# Altium project ir_probe.PrjPcb
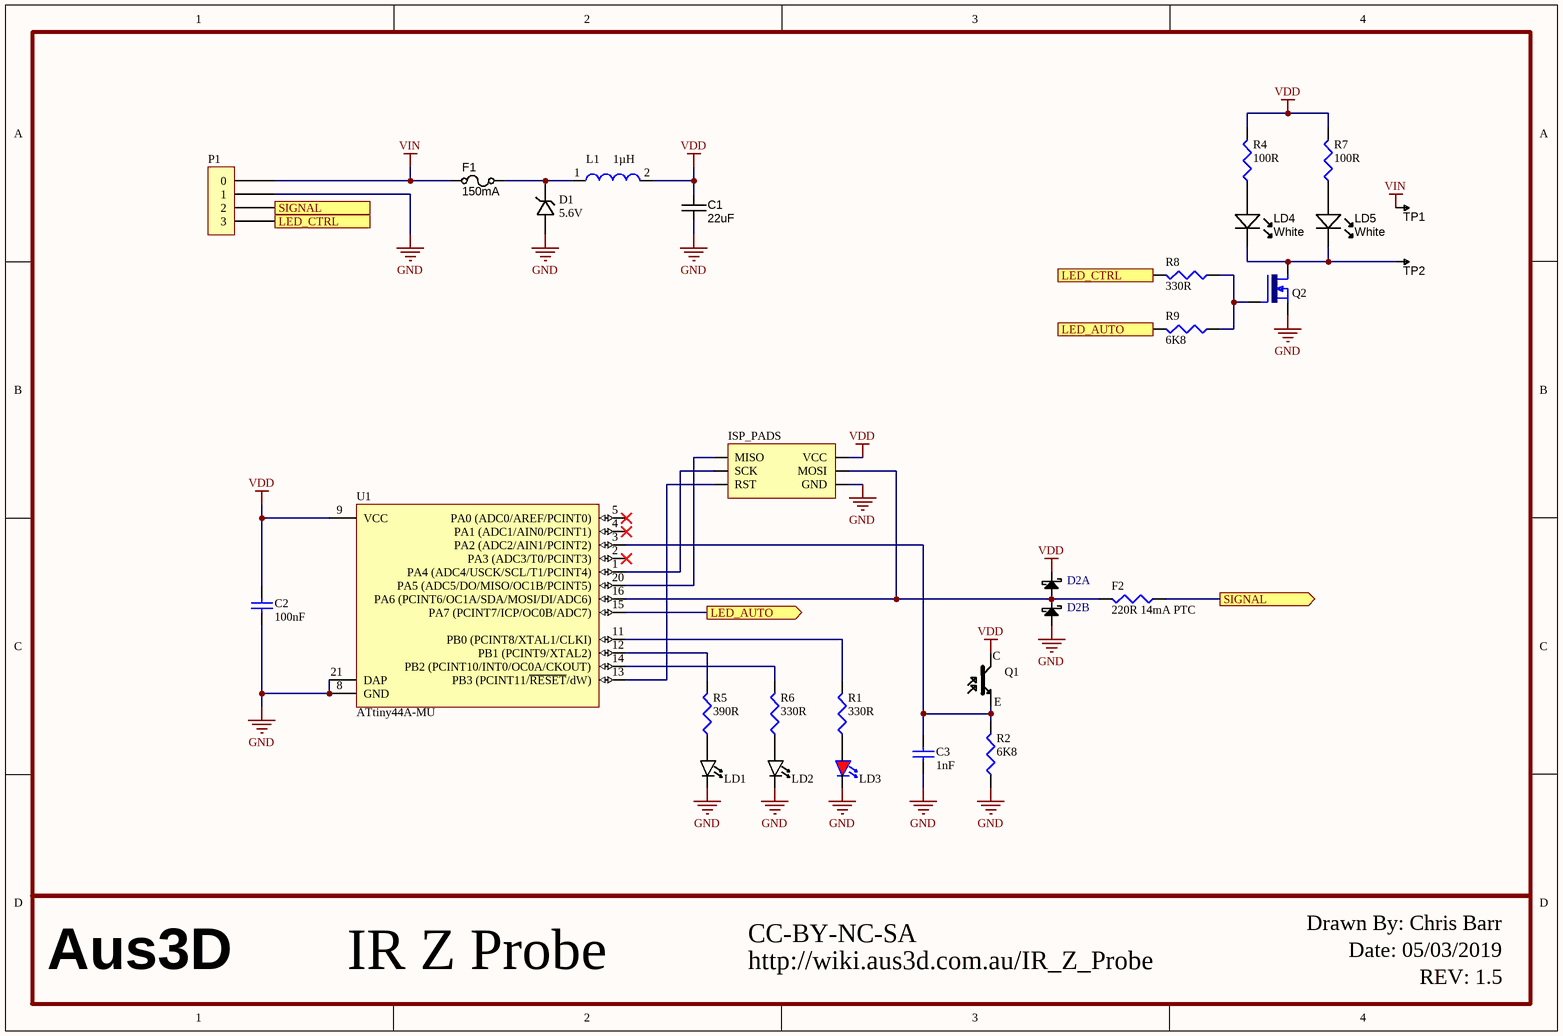
[diagram p0: ir_probe.SchDoc]
1 sheet, 28 parts. Net scope: flat (ports and power ports of the same name join across sheets).
Board file: ir_probe.PcbDoc

## Sheet ir_probe.SchDoc
size A4

### Parts
C1  value 22uF  [CAPC3216X180N]  (hidden comment: 22uF 20% 16V X7R 1206)
C2  value 100nF  [CAPC1608X90N]  (hidden comment: 100nF 10% 50V X7R 0603)
C3  value 1nF  [CAPC1608X90N]  (hidden comment: 1nF 10% 50V X7R 0603)
D1  value 5.6V  [SOD123]  (hidden comment: 5.6V 0.5W SOD-123)
D2  Dual 100mA 30V SOT23-3  [SOT23-3 New]  (value not drawn)  (parts A,B of 2)
F1  value 150mA  [RES 3216-1206]  (hidden comment: 60V 200mA Hold 400mA Trip 1206)
F2  value 220R 14mA PTC  [RESC1608X55N]  (hidden comment: 24V 14mA Hold 29mA Trip 220R 0603)
ISP_PADS  ISP  [ICSP Pads]  (value not drawn)  (no BOM)
L1  Inductance: 1µH  [SMD-0603]  (hidden comment: 1uH 20% 600mA 0603)
LD1  IR 950nm 1.6V 70mA Side-View  [SFH 4045N IR LED]  (value not drawn)
LD2  IR 950nm 1.6V 70mA Side-View  [SFH 4045N IR LED]  (value not drawn)
LD3  Red 0603  [LED 1608-0603]  (value not drawn)
LD4  Color: White  [LED-0602-SideView]  (hidden comment: White Side-View 0602)
LD5  Color: White  [LED-0602-SideView]  (hidden comment: White Side-View 0602)
P1  JST-SH 4P Side-Entry .1"  [SM04B-SRSS-TB]  (value not drawn)
Q1  NPN 30V 15mA IR 870nm Side-View  [SFH 4045N IR LED]  (value not drawn)
Q2  N-CH MOSFET 30V 5.7A SOT23  [SOT23-3 New]  (value not drawn)
R1  value 330R  [RESC1608X55N]  (hidden comment: 330R 1% 100mW 0603)
R2  value 6K8  [RESC1608X55N]  (hidden comment: 6K8 1% 100mW 0603)
R4  value 100R  [RES 1608-0603]  (hidden comment: 100R 1% 100mW 0603)
R5  value 390R  [RESC1608X55N]  (hidden comment: 390R 1% 100mW 0603)
R6  value 330R  [RESC1608X55N]  (hidden comment: 330R 1% 100mW 0603)
R7  value 100R  [RES 1608-0603]  (hidden comment: 100R 1% 100mW 0603)
R8  value 330R  [RESC1608X55N]  (hidden comment: 330R 1% 100mW 0603)
R9  value 6K8  [RESC1608X55N]  (hidden comment: 6K8 1% 100mW 0603)
TP1  TESTPOINT  [TP-R60]  (value not drawn)  (no BOM)
TP2  TESTPOINT  [TP-R60]  (value not drawn)  (no BOM)
U1  value ATtiny44A-MU  [20M1_N]  (hidden comment: ATtiny44A-MU - 8-bit AVR Microcontroller,  20MHz, 1.8-5.5V, 4KB Flash, 256 Bytes EEPROM, 256 Bytes SRAM, 20-pin MLF, Industrial Grade (-40°C to 85°C), Pb-Free)

### Ports
LED_AUTO (in), LED_AUTO (out), LED_CTRL (in), LED_CTRL (out), SIGNAL (in), SIGNAL (out)

### Nets
GND: C1.2 C2.1 C3.1 D1.A D2.1(A) ISP_PADS.5(GND) LD1.1(K) LD2.1(K) LD3.2(K) P1.1 Q2.2(S) R2.1 U1.8(GND) U1.21(DAP)
VDD: C1.1 C2.2 D2.2(K) ISP_PADS.1(VCC) L1.2 Q1.2 R4.2 R7.2 U1.9(VCC)
VIN: F1.1 P1.0 TP1.1
NetC3_2: C3.2 Q1.1 R2.2 U1.3(PA2_(ADC2/AIN1/PCINT2))
NetD1_K: D1.K F1.2 L1.1
NetD2_3: D2.3(A) F2.2 ISP_PADS.3(MOSI) U1.16(PA6_(PCINT6/OC1A/SDA/MOSI/DI/ADC6))
NetF2_1: F2.1 P1.2 ; port SIGNAL
NetISP_PADS_0: ISP_PADS.0(MISO) U1.20(PA5_(ADC5/DO/MISO/OC1B/PCINT5))
NetISP_PADS_2: ISP_PADS.2(SCK) U1.1(PA4_(ADC4/USCK/SCL/T1/PCINT4))
NetISP_PADS_4: ISP_PADS.4(RST) U1.13(PB3_(PCINT11/~{RESET}/dW))
NetLD1_2: LD1.2(A) R5.1
NetLD2_2: LD2.2(A) R6.1
NetLD3_1: LD3.1(A) R1.1
NetLD4_A: LD4.A R4.1
NetLD4_K: LD4.K LD5.K Q2.3(D) TP2.1
NetLD5_A: LD5.A R7.1
NetP1_3: P1.3 R8.2 ; port LED_CTRL
NetQ2_1: Q2.1(G) R8.1 R9.1
NetR1_2: R1.2 U1.11(PB0_(PCINT8/XTAL1/CLKI))
NetR5_2: R5.2 U1.12(PB1_(PCINT9/XTAL2))
NetR6_2: R6.2 U1.14(PB2_(PCINT10/INT0/OC0A/CKOUT))
NetR9_2: R9.2 U1.15(PA7_(PCINT7/ICP/OC0B/ADC7)) ; port LED_AUTO

Not connected (* = marked no-connect by the designer): U1 2(PA3_(ADC3/T0/PCINT3))* 4(PA1_(ADC1/AIN0/PCINT1))* 5(PA0_(ADC0/AREF/PCINT0))*

### Notes on the sheet
- Drawn By: Chris Barr
- Aus3D
- IR Z Probe
- http://wiki.aus3d.com.au/IR_Z_Probe
- CC-BY-NC-SA
- Date: 05/03/2019
- REV: 1.5
- Title
- Size:
- Date:
- A4
- Number:
- Time:
- Revision:
- Sheet
- of
- File:
- (in symbol Phototransistor - NPN - SFH 3015 FA) C; E

### Library data of the parts
C1 = CAPC_10u_1206_16V: Capacitor, Ceramic (SMD); Tolerance: ±10%; Ratings: 16V; X7R; SCDType: spec; Note: Approved Sub OK; Package / Case: 1206 (3216 metric); Supplier 1: Digi-Key; Supplier Part Number 1: 587-4319-1-ND
C2 C3 = CapC-0603-100nF: Capacitor, Ceramic (SMD); Note: Approved Sub OK; Published: 8-Jun-2000; Revision: July-2002: Re-released for DXP Platform.; Publisher: Altium Limited; Supplier 1: Digi-Key
  C2: Supplier Part Number 1: 311-1344-1-ND
  C3: Supplier Part Number 1: 311-1080-1-ND
D1 = DIODE_ZENER_5.6V_500mW: Diode, Zener (SMD); Ratings: 5.6V; 0.5W; Vf=900mV @ 10mA; Material: Si; Tolerance: ±7%; SCDType: source; Note: Approved Sub OK; Package / Case: SOD-123; Diode Type: Zener; Supplier 1: Digi-Key; Supplier Part Number 1: BZT52C5V6-FDICT-ND
D2 = Diode Schottky BAT54S: Diode, Schottky (SMD); Note: Approved sub OK; Revision: July-2002: Re-released for DXP Platform.; Supplier 1: Digi-Key; Supplier Part Number 1: BAT54SLT1GOSCT-ND
F1 = Fuse - 30V 400mA Trip PTC SMD 1206: PTC Resettable Fuse (SMD); Note: Approved Sub OK; Package / Case: 1206 (3216 metric); Supplier 1: Digi-Key; Supplier Part Number 1: 507-1797-1-ND
F2 = Res-0603-1K: PTC Resettable Fuse (SMD); Note: Approved Sub OK; Published: 8-Jun-2000; Revision: July-2002: Re-released for DXP Platform.; Publisher: Altium Limited; Supplier 1: Digi-Key; Supplier Part Number 1: 490-2470-1-ND
ISP_PADS = ISP Header: Note: Approved Sub OK
L1 = 7447965: Inductor (SMD); Note: Approved Sub OK; DatasheetVersion: ver 5, Oct-2004; PackageVersion: 2009; PackageReference: SMD-0603; PackageDescription: Chip Inductor, 2-Leads, Body 1.6 x 0.8 mm; ComponentLink1Description: Manufacturer URL; ComponentLink1URL: http://www.we-online.com; ComponentLink2Description: Datasheet; ComponentLink2URL: http://www.we-online.de/katalog/media/pdf/7447965.pdf; Supplier 1: Digi-Key; Supplier Part Number 1: 445-6384-1-ND
LD1 LD2 = LED IR SFH 4045N: LED (SMD); Note: Approved Sub OK; Supplier 1: Digi-Key; Supplier Part Number 1: 475-3047-1-ND
LD3 = LEDR  0603: LED (SMD); Note: Approved Sub OK; Supplier 1: Digi-Key; Supplier Part Number 1: 160-1436-1-ND
LD4 LD5 = LED_SMD_White_0602_250mcd: LED (SMD); Material: GaP; Ratings: 12 mcd; 569 nm; SCDType: source; Note: Approved Sub OK; Package / Case: 0805; Value: White; Supplier 1: Digi-Key; Supplier Part Number 1: 1516-1080-1-ND
P1 = SM04B-SRSS-TB: Connector (SMD); Note: Approved Sub OK; Supplier 1: Digi-Key; Supplier Part Number 1: 455-1804-1-ND
Q1 = Phototransistor - NPN - SFH 3015 FA: Phototransistor (SMD); Note: Approved Sub OK; Supplier 1: Digi-Key; Supplier Part Number 1: 475-2914-1-ND
Q2 = MOSFET - AO3400A: MOSFET (SMD); Note: Approved Sub OK; Supplier 1: Digi-Key; Supplier Part Number 1: 785-1000-1-ND
R1 R2 R5 R6 R8 R9 = Res-0603-1K: Resistor (SMD); Note: Approved Sub OK; Published: 8-Jun-2000; Revision: July-2002: Re-released for DXP Platform.; Publisher: Altium Limited; Supplier 1: Digi-Key
  R1 R6 R8: Supplier Part Number 1: 311-330HRCT-ND
  R2 R9: Supplier Part Number 1: 311-6.80KHRCT-ND
  R5: Supplier Part Number 1: 311-390HRCT-ND
R4 R7 = Res-0603-100R: Resistor (SMD); Note: Approved Sub OK; Published: 8-Jun-2000; Revision: July-2002: Re-released for DXP Platform.; Publisher: Altium Limited; Supplier 1: Digi-Key; Supplier Part Number 1: 311-100HRCT-ND
TP1 TP2 = TESTPOINT: SMD test pin; Note: Approved Sub OK
U1 = ATtiny44A-MU: Microcontroller (SMD); Note: Approved Sub OK; DatasheetVersion: revD, Apr-2011; PackageVersion: revA, Oct-2004; PackageReference: 20M1; PackageDescription: 20-pad, 4 x 4 x 0.8 mm Body, Lead Pitch 0.50 mm, 2.6 mm Exposed Pad, Micro Lead Frame Package (MLF); Code_JEDEC: MO-220WGGD-5; ComponentLink1Description: Manufacturer URL; ComponentLink1URL: http://www.atmel.com/; ComponentLink2Description: ATtiny24A/44A/84A Datasheet; ComponentLink2URL: http://www.atmel.com/dyn/resources/prod_documents/doc8183.pdf; ComponentLink3Description: ATtiny24A/44A/84A Summary; ComponentLink3URL: http://www.atmel.com/dyn/resources/prod_documents/8183S.pdf; Supplier 1: Digi-Key; Supplier Part Number 1: ATTINY44A-MU-ND